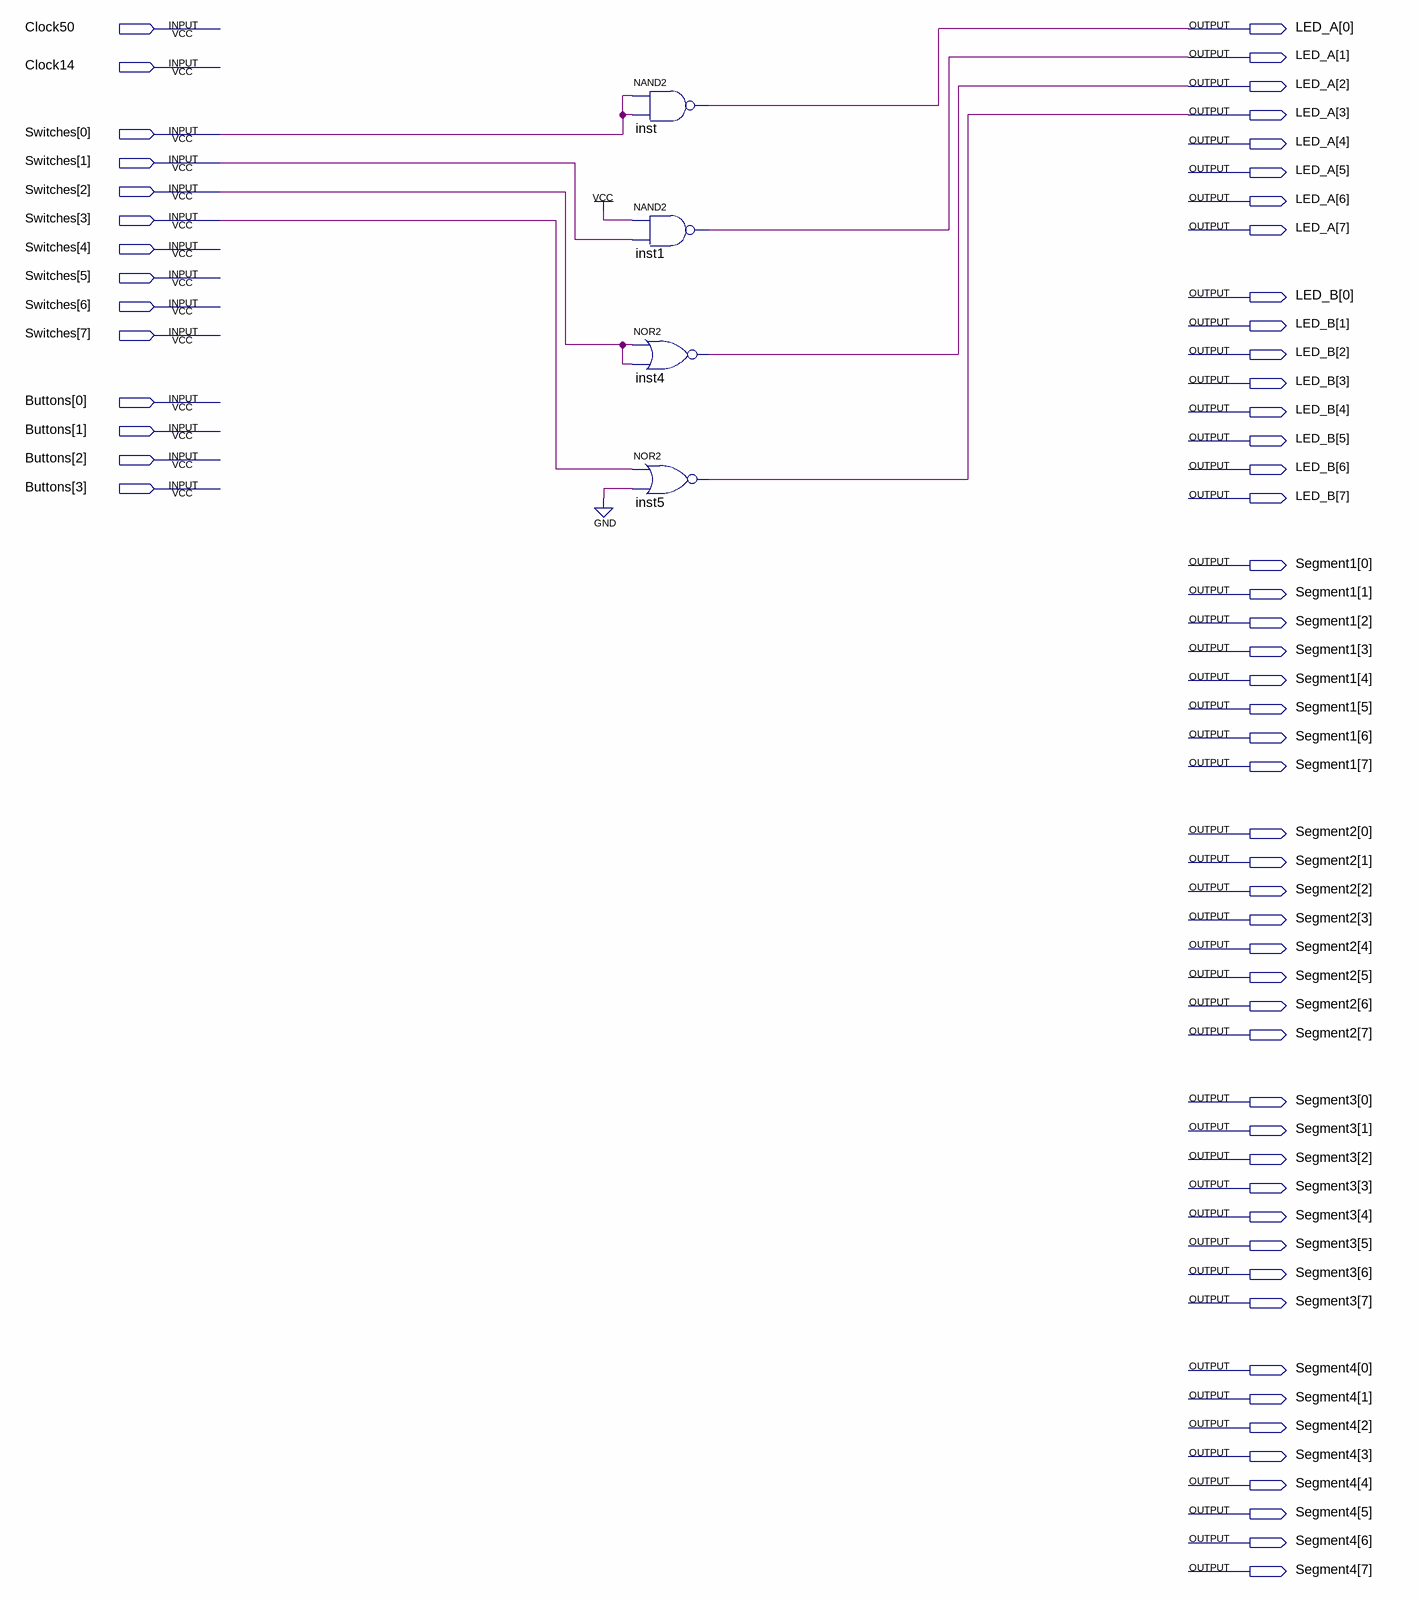
[diagram p0: schematic sheet]
// Quartus schematic Inverter.bdf as structural Verilog: 4 symbols, 62 pins
module Inverter (
  input  Clock50,
  input  Clock14,
  input  [7:0] Switches,
  input  [3:0] Buttons,
  output [7:0] LED_A,
  output [7:0] LED_B,
  output [7:0] Segment1,
  output [7:0] Segment2,
  output [7:0] Segment3,
  output [7:0] Segment4
);

  nand inst (LED_A[0], Switches[0], Switches[0]);
  nand inst1 (LED_A[1], 1'b1, Switches[1]);
  nor inst4 (LED_A[2], Switches[2], Switches[2]);
  nor inst5 (LED_A[3], Switches[3], 1'b0);
endmodule
